# Altium project picr22-team-owo-mainboard.PrjPcb
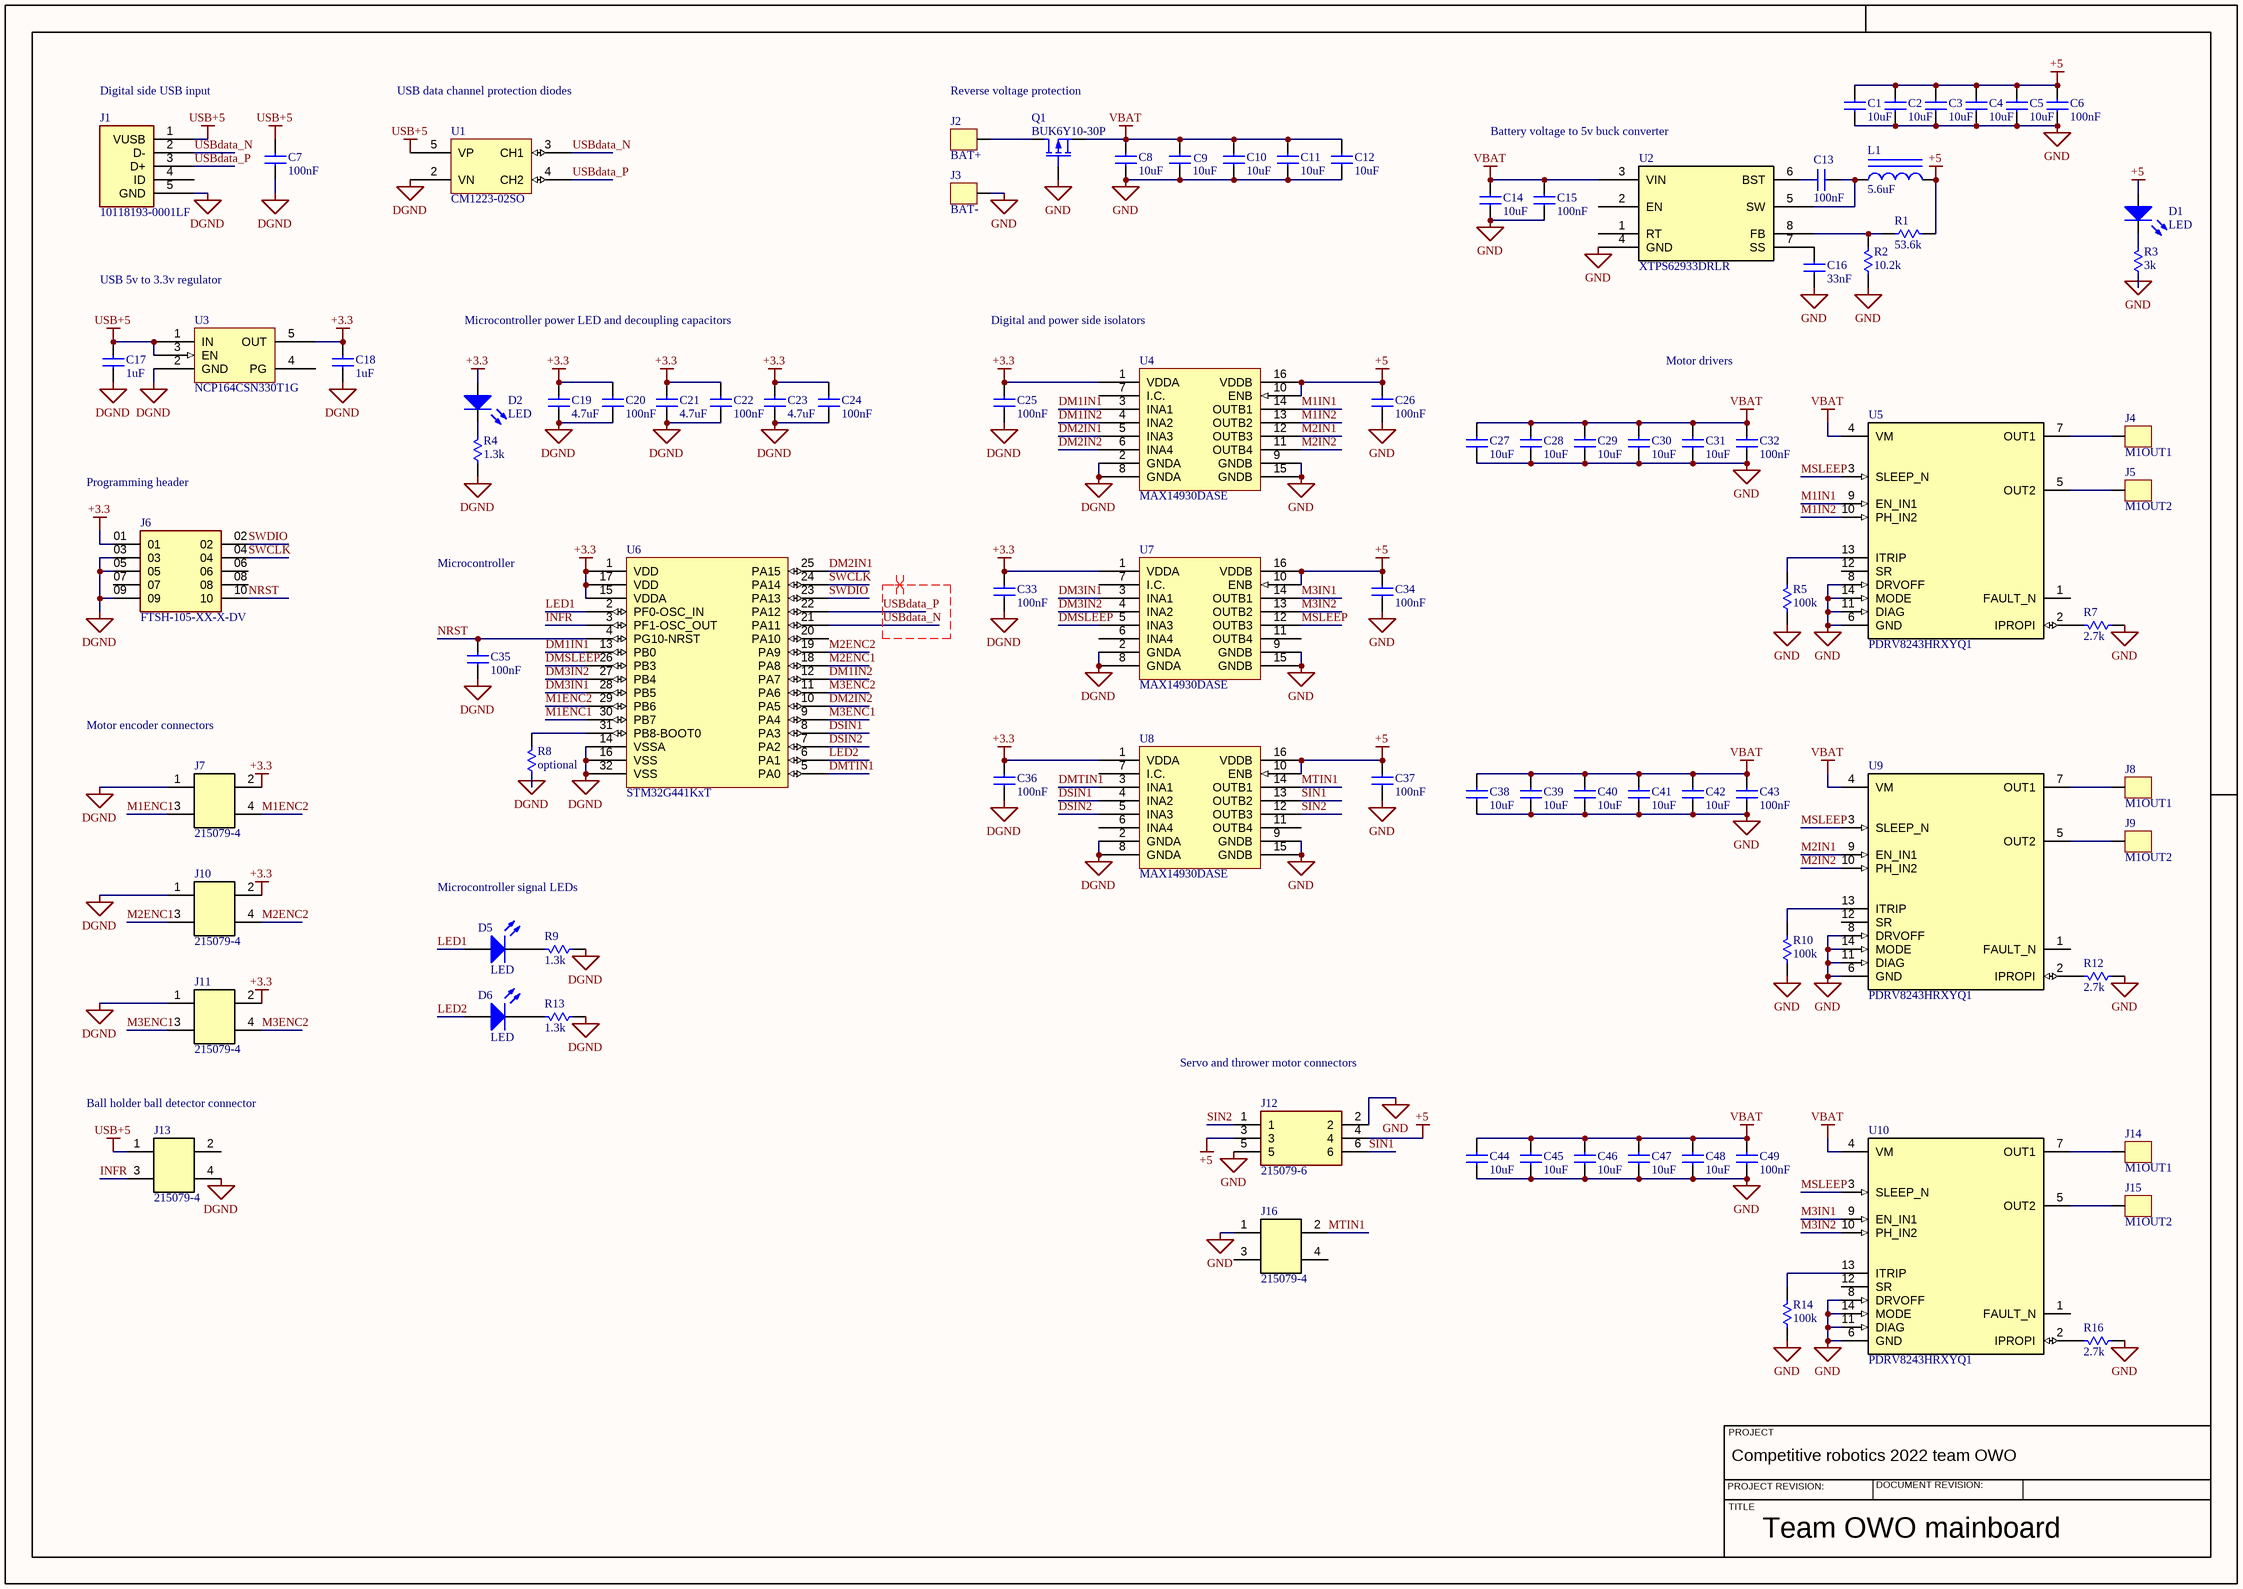
[diagram p0: picr22-team-owo-mainboard.SchDoc]
1 sheet, 94 parts. Net scope: global (net labels, ports and power ports of the same name join across sheets).
Board file: picr22-team-owo-mainboard.PcbDoc

## Sheet picr22-team-owo-mainboard.SchDoc: Team OWO mainboard
size 420 x 297 mm; SheetNumber: 1; SheetTotal: 1; SPICEModelCacheXBEYWOXU: <root> / <DocumentId>XBEYWOXU</DocumentId> / </root>; Project: Competitive robotics 2022 team OWO

### Parts
C1  value 10uF  [Capacitor 1206]  (hidden comment: Generic SMD capacitor)
C2  value 10uF  [Capacitor 1206]  (hidden comment: Generic SMD capacitor)
C3  value 10uF  [Capacitor 1206]  (hidden comment: Generic SMD capacitor)
C4  value 10uF  [Capacitor 1206]  (hidden comment: Generic SMD capacitor)
C5  value 10uF  [Capacitor 1206]  (hidden comment: Generic SMD capacitor)
C6  value 100nF  [Capacitor 0603]  (hidden comment: Generic SMD capacitor)
C7  value 100nF  [Capacitor 0603]  (hidden comment: Generic SMD capacitor)
C8  value 10uF  [Capacitor 1206]  (hidden comment: Generic SMD capacitor)
C9  value 10uF  [Capacitor 1206]  (hidden comment: Generic SMD capacitor)
C10  value 10uF  [Capacitor 1206]  (hidden comment: Generic SMD capacitor)
C11  value 10uF  [Capacitor 1206]  (hidden comment: Generic SMD capacitor)
C12  value 10uF  [Capacitor 1206]  (hidden comment: Generic SMD capacitor)
C13  value 100nF  [Capacitor 0603]  (hidden comment: Generic SMD capacitor)
C14  value 10uF  [Capacitor 1206]  (hidden comment: Generic SMD capacitor)
C15  value 100nF  [Capacitor 0603]  (hidden comment: Generic SMD capacitor)
C16  value 33nF  [Capacitor 0603]  (hidden comment: Generic SMD capacitor)
C17  value 1uF  [Capacitor 0603]  (hidden comment: Generic SMD capacitor)
C18  value 1uF  [Capacitor 0603]  (hidden comment: Generic SMD capacitor)
C19  value 4.7uF  [Capacitor 1206]  (hidden comment: Generic SMD capacitor)
C20  value 100nF  [Capacitor 0603]  (hidden comment: Generic SMD capacitor)
C21  value 4.7uF  [Capacitor 1206]  (hidden comment: Generic SMD capacitor)
C22  value 100nF  [Capacitor 0603]  (hidden comment: Generic SMD capacitor)
C23  value 4.7uF  [Capacitor 1206]  (hidden comment: Generic SMD capacitor)
C24  value 100nF  [Capacitor 0603]  (hidden comment: Generic SMD capacitor)
C25  value 100nF  [Capacitor 0603]  (hidden comment: Generic SMD capacitor)
C26  value 100nF  [Capacitor 0603]  (hidden comment: Generic SMD capacitor)
C27  value 10uF  [Capacitor 1206]  (hidden comment: Generic SMD capacitor)
C28  value 10uF  [Capacitor 1206]  (hidden comment: Generic SMD capacitor)
C29  value 10uF  [Capacitor 1206]  (hidden comment: Generic SMD capacitor)
C30  value 10uF  [Capacitor 1206]  (hidden comment: Generic SMD capacitor)
C31  value 10uF  [Capacitor 1206]  (hidden comment: Generic SMD capacitor)
C32  value 100nF  [Capacitor 0603]  (hidden comment: Generic SMD capacitor)
C33  value 100nF  [Capacitor 0603]  (hidden comment: Generic SMD capacitor)
C34  value 100nF  [Capacitor 0603]  (hidden comment: Generic SMD capacitor)
C35  value 100nF  [Capacitor 0603]  (hidden comment: Generic SMD capacitor)
C36  value 100nF  [Capacitor 0603]  (hidden comment: Generic SMD capacitor)
C37  value 100nF  [Capacitor 0603]  (hidden comment: Generic SMD capacitor)
C38  value 10uF  [Capacitor 1206]  (hidden comment: Generic SMD capacitor)
C39  value 10uF  [Capacitor 1206]  (hidden comment: Generic SMD capacitor)
C40  value 10uF  [Capacitor 1206]  (hidden comment: Generic SMD capacitor)
C41  value 10uF  [Capacitor 1206]  (hidden comment: Generic SMD capacitor)
C42  value 10uF  [Capacitor 1206]  (hidden comment: Generic SMD capacitor)
C43  value 100nF  [Capacitor 0603]  (hidden comment: Generic SMD capacitor)
C44  value 10uF  [Capacitor 1206]  (hidden comment: Generic SMD capacitor)
C45  value 10uF  [Capacitor 1206]  (hidden comment: Generic SMD capacitor)
C46  value 10uF  [Capacitor 1206]  (hidden comment: Generic SMD capacitor)
C47  value 10uF  [Capacitor 1206]  (hidden comment: Generic SMD capacitor)
C48  value 10uF  [Capacitor 1206]  (hidden comment: Generic SMD capacitor)
C49  value 100nF  [Capacitor 0603]  (hidden comment: Generic SMD capacitor)
D1  LED  [DIODE 0603]
D2  LED  [DIODE 0603]
D5  LED  [DIODE 0603]
D6  LED  [DIODE 0603]
J1  10118193-0001LF  [USB port]
J2  BAT+  [5x5mm pad]
J3  BAT-  [5x5mm pad]
J4  M1OUT1  [3x3mm pad]
J5  M1OUT2  [3x3mm pad]
J6  FTSH-105-XX-X-DV  [SAMTEC_FTSH-105-XX-X-DV]
J7  215079-4  [CONN_215079-4_TYC]
J8  M1OUT1  [3x3mm pad]
J9  M1OUT2  [3x3mm pad]
J10  215079-4  [CONN_215079-4_TYC]
J11  215079-4  [CONN_215079-4_TYC]
J12  215079-6  [CONN_215079-6_TYC]
J13  215079-4  [CONN_215079-4_TYC]
J14  M1OUT1  [3x3mm pad]
J15  M1OUT2  [3x3mm pad]
J16  215079-4  [CONN_215079-4_TYC]
L1  value 5.6uF  [Inductor ?]  (hidden comment: Inductor)
Q1  BUK6Y10-30P  [DPAK127P600X120-5N]
R1  value 53.6k  [Resistor 0603]  (hidden comment: Generic SMD resistor)
R2  value 10.2k  [Resistor 0603]  (hidden comment: Generic SMD resistor)
R3  value 3k  [Resistor 0603]  (hidden comment: Generic SMD resistor)
R4  value 1.3k  [Resistor 0603]  (hidden comment: Generic SMD resistor)
R5  value 100k  [Resistor 0603]  (hidden comment: Generic SMD resistor)
R7  value 2.7k  [Resistor 0603]  (hidden comment: Generic SMD resistor)
R8  value optional  [Resistor 0603]  (hidden comment: Generic SMD resistor)
R9  value 1.3k  [Resistor 0603]  (hidden comment: Generic SMD resistor)
R10  value 100k  [Resistor 0603]  (hidden comment: Generic SMD resistor)
R12  value 2.7k  [Resistor 0603]  (hidden comment: Generic SMD resistor)
R13  value 1.3k  [Resistor 0603]  (hidden comment: Generic SMD resistor)
R14  value 100k  [Resistor 0603]  (hidden comment: Generic SMD resistor)
R16  value 2.7k  [Resistor 0603]  (hidden comment: Generic SMD resistor)
U1  CM1223-02SO  [SOT95P280X145-5N]
U2  XTPS62933DRLR  [SOT-5X3 8N]
U3  NCP164CSN330T1G  [TSOP95P280X110-5N]
U4  MAX14930DASE  [SOIC127P630X175-16N]
U5  PDRV8243HRXYQ1  [RXY0014A-MFG]
U6  STM32G441KxT  [TQFP80P900X900X160-32N]
U7  MAX14930DASE  [SOIC127P630X175-16N]
U8  MAX14930DASE  [SOIC127P630X175-16N]
U9  PDRV8243HRXYQ1  [RXY0014A-MFG]
U10  PDRV8243HRXYQ1  [RXY0014A-MFG]

### Nets
+3.3: C18.2 C19.2 C20.2 C21.2 C22.2 C23.2 C24.2 C25.2 C33.2 C36.2 D2.1(A) J6.01 J7.2 J10.2 J11.2 U3.5(OUT) U4.1(VDDA) U6.1(VDD) U6.15(VDDA) U6.17(VDD) U7.1(VDDA) U8.1(VDDA)
+5: C1.2 C2.2 C3.2 C4.2 C5.2 C6.1 C26.2 C34.2 C37.2 D1.1(A) J12.3 J12.4 L1.2 R1.2 U4.10(ENB) U4.16(VDDB) U7.10(ENB) U7.16(VDDB) U8.10(ENB) U8.16(VDDB)
DGND: C7.1 C17.1 C18.1 C19.1 C20.1 C21.1 C22.1 C23.1 C24.1 C25.1 C33.1 C35.1 C36.1 J1.5(GND) J6.03 J6.05 J6.09 J7.1 J10.1 J11.1 J13.4 R4.1 R8.1 R9.1 R13.1 U1.2(VN) U3.2(GND) U4.2(GNDA) U4.8(GNDA) U6.14(VSSA) U6.16(VSS) U6.32(VSS) U7.2(GNDA) U7.8(GNDA) U8.2(GNDA) U8.8(GNDA)
GND: C1.1 C2.1 C3.1 C4.1 C5.1 C6.2 C8.1 C9.1 C10.1 C11.1 C12.1 C14.1 C15.1 C16.2 C26.1 C27.1 C28.1 C29.1 C30.1 C31.1 C32.1 C34.1 C37.1 C38.1 C39.1 C40.1 C41.1 C42.1 C43.1 C44.1 C45.1 C46.1 C47.1 C48.1 C49.1 J3.1 J12.2 J12.5 J16.1 Q1.4(G) R2.1 R3.1 R5.1 R7.1 R10.1 R12.1 R14.1 R16.1 U2.4(GND) U4.9(GNDB) U4.15(GNDB) U5.6(GND) U5.8(DRVOFF) U5.11(DIAG) U5.14(MODE) U7.9(GNDB) U7.15(GNDB) U8.9(GNDB) U8.15(GNDB) U9.6(GND) U9.8(DRVOFF) U9.11(DIAG) U9.14(MODE) U10.6(GND) U10.8(DRVOFF) U10.11(DIAG) U10.14(MODE)
USB+5: C7.2 C17.2 J1.1(VUSB) J13.1 U1.5(VP) U3.1(IN) U3.3(EN)
VBAT: C8.2 C9.2 C10.2 C11.2 C12.2 C14.2 C15.2 C27.2 C28.2 C29.2 C30.2 C31.2 C32.2 C38.2 C39.2 C40.2 C41.2 C42.2 C43.2 C44.2 C45.2 C46.2 C47.2 C48.2 C49.2 Q1.1,2,3(S) U2.3(VIN) U5.4(VM) U9.4(VM) U10.4(VM)
DM1IN1: U4.3(INA1) U6.13(PB0)
DM1IN2: U4.4(INA2) U6.12(PA7)
DM2IN1: U4.5(INA3) U6.25(PA15)
DM2IN2: U4.6(INA4) U6.10(PA5)
DM3IN1: U6.28(PB5) U7.3(INA1)
DM3IN2: U6.27(PB4) U7.4(INA2)
DMSLEEP: U6.26(PB3) U7.5(INA3)
DMTIN1: U6.5(PA0) U8.3(INA1)
DSIN1: U6.8(PA3) U8.4(INA2)
DSIN2: U6.7(PA2) U8.5(INA3)
INFR: J13.3 U6.3(PF1-OSC_OUT)
LED1: D5.1(A) U6.2(PF0-OSC_IN)
LED2: D6.1(A) U6.6(PA1)
M1ENC1: J7.3 U6.30(PB7)
M1ENC2: J7.4 U6.29(PB6)
M1IN1: U4.14(OUTB1) U5.9(EN_IN1)
M1IN2: U4.13(OUTB2) U5.10(PH_IN2)
M2ENC1: J10.3 U6.18(PA8)
M2ENC2: J10.4 U6.19(PA9)
M2IN1: U4.12(OUTB3) U9.9(EN_IN1)
M2IN2: U4.11(OUTB4) U9.10(PH_IN2)
M3ENC1: J11.3 U6.9(PA4)
M3ENC2: J11.4 U6.11(PA6)
M3IN1: U7.14(OUTB1) U10.9(EN_IN1)
M3IN2: U7.13(OUTB2) U10.10(PH_IN2)
MSLEEP: U5.3(SLEEP_N) U7.12(OUTB3) U9.3(SLEEP_N) U10.3(SLEEP_N)
MTIN1: J16.2 U8.14(OUTB1)
NRST: C35.2 J6.10 U6.4(PG10-NRST)
SIN1: J12.6 U8.13(OUTB2)
SIN2: J12.1 U8.12(OUTB3)
SWCLK: J6.04 U6.24(PA14)
SWDIO: J6.02 U6.23(PA13)
USBdata_N: J1.2(D-) U1.3(CH1) U6.21(PA11)
USBdata_P: J1.3(D+) U1.4(CH2) U6.22(PA12)
NetC13_1: C13.1 L1.1 U2.5(SW)
NetC13_2: C13.2 U2.6(BST)
NetC16_1: C16.1 U2.7(SS)
NetD1_2: D1.2(K) R3.2
NetD2_2: D2.2(K) R4.2
NetD5_2: D5.2(K) R9.2
NetD6_2: D6.2(K) R13.2
NetJ2_1: J2.1 Q1.5(D)
NetJ4_1: J4.1 U5.7(OUT1)
NetJ5_1: J5.1 U5.5(OUT2)
NetJ8_1: J8.1 U9.7(OUT1)
NetJ9_1: J9.1 U9.5(OUT2)
NetJ14_1: J14.1 U10.7(OUT1)
NetJ15_1: J15.1 U10.5(OUT2)
NetR1_1: R1.1 R2.2 U2.8(FB)
NetR5_2: R5.2 U5.13(ITRIP)
NetR7_2: R7.2 U5.2(IPROPI)
NetR8_2: R8.2 U6.31(PB8-BOOT0)
NetR10_2: R10.2 U9.13(ITRIP)
NetR12_2: R12.2 U9.2(IPROPI)
NetR14_2: R14.2 U10.13(ITRIP)
NetR16_2: R16.2 U10.2(IPROPI)

Not connected (* = marked no-connect by the designer): J1 4(ID); J6 06 07 08; J13 2; J16 3 4; U2 1(RT) 2(EN); U3 4(PG); U4 7(I.C.); U5 1(FAULT_N) 12(SR); U6 20(PA10); U7 6(INA4) 7(I.C.) 11(OUTB4); U8 6(INA4) 7(I.C.) 11(OUTB4); U9 1(FAULT_N) 12(SR); U10 1(FAULT_N) 12(SR)

### Layout directives
differential pair; differential pair class USB: USBdata_N, USBdata_P

### Notes on the sheet
- (near J1) Digital side USB input
- USB data channel protection diodes
- Reverse voltage protection
- Battery voltage to 5v buck converter
- USB 5v to 3.3v regulator
- Microcontroller power LED and decoupling capacitors
- Digital and power side isolators
- Motor drivers
- Programming header
- Microcontroller
- Motor encoder connectors
- Microcontroller signal LEDs
- Servo and thrower motor connectors
- (near J13) Ball holder ball detector connector
- PROJECT
- PROJECT REVISION:
- TITLE
- DOCUMENT REVISION:

### Library data of the parts
C1-C49 = Capacitor
J1 = 10118193-0001LF: USB - micro B USB 2.0 Receptacle Connector 5 Position Surface Mount, Right Angle; Through Hole; MF: Amphenol ICC; Availability: Unavailable; SnapEDA_Link: https://www.snapeda.com/parts/10118193-0001LF/Amphenol%20FCI/view-part/2758989/?ref=snap; MP: 10118193-0001LF; Price: None; Value: *; Package: None
J2-J5 J8 J9 J14 J15 = Connector pad
J6 = FTSH-105-XX-X-DV: Connector Header Surface Mount 10 position 0.050" (1.27mm); Availability: Unavailable; Package: None; MP: FTSH-105-XX-X-DV; Price: None; Value: *
J7 J10 J11 J13 J16 = 215079-4: No Description Available; Mfr_Name: TE Connectivity; Copyright: Copyright (C) 2022 Ultra Librarian. All rights reserved.; Manufacturer_Part_Number: 215079-4; RefDes: RefDes; Type: DEV
R1-R5 R7-R10 R12-R14 R16 = Resistor
U4 U7 U8 = MAX14930DASE+
U5 U9 U10 = PDRV8243HRXYQ1: No Description Available; Mfr_Name: Texas Instruments; Type: DEV; RefDes: RefDes; Copyright: Copyright (C) 2022 Ultra Librarian. All rights reserved.; Manufacturer_Part_Number: PDRV8243HRXYQ1